# Altium project AeroPressureSensors.PrjPCB
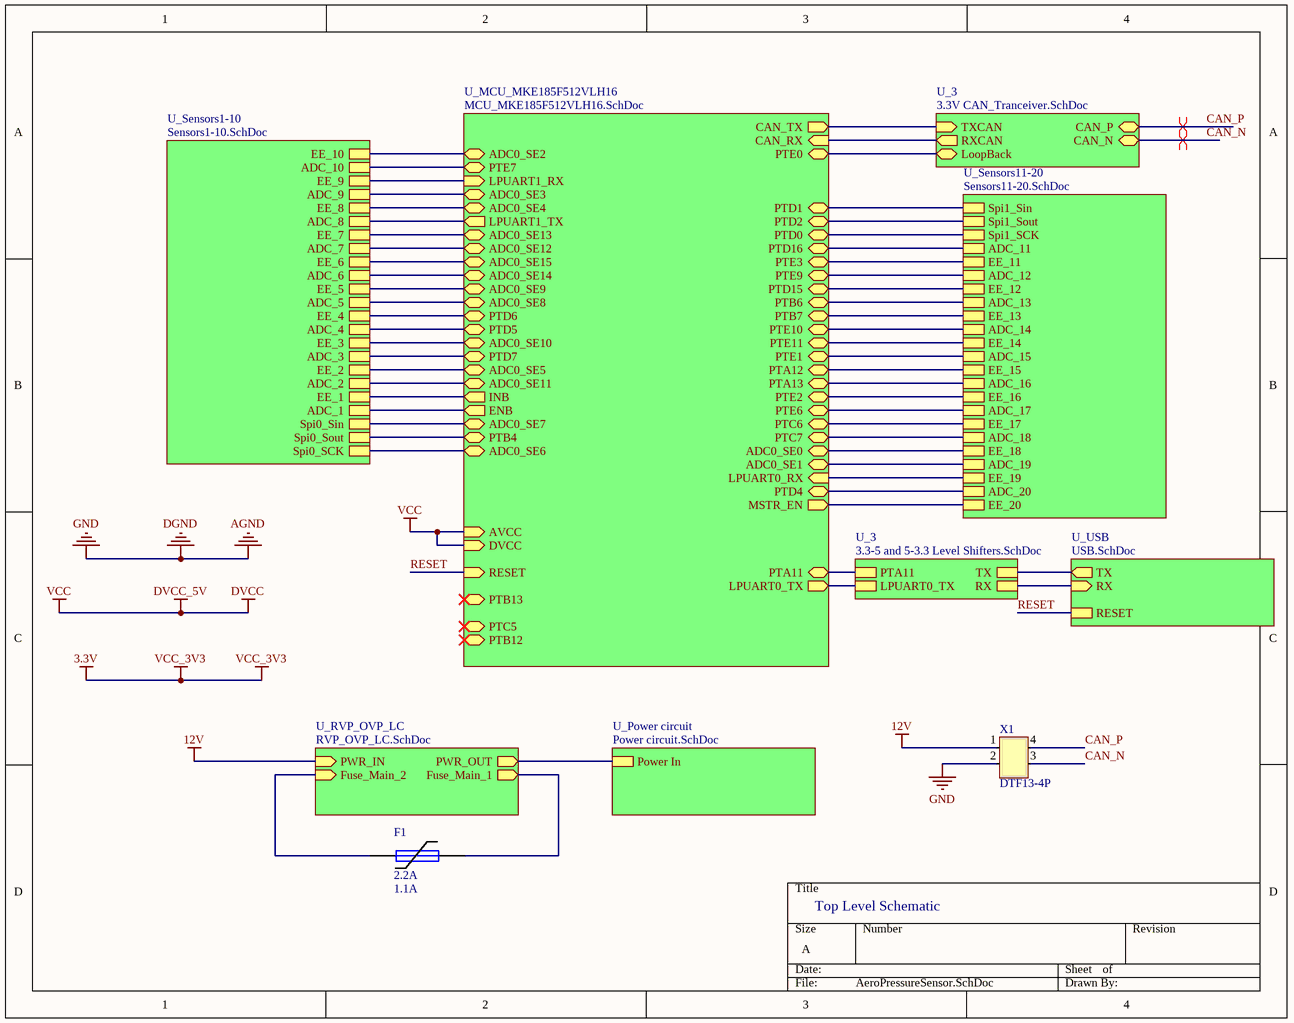
[diagram p0: AeroPressureSensor.SchDoc]
6 sheets, 127 parts. Net scope: hierarchical (ports join the sheet entries above them; power ports are global).
Board file: Pressure_Tap_Board.PcbDoc
Sheets:
  AeroPressureSensor.SchDoc
    U_Sensors1-10 = Sensors1-10.SchDoc
    U_Sensors11-20 = Sensors11-20.SchDoc
    U_Power circuit = Power circuit.SchDoc
    U_3 = 3.3V CAN_Tranceiver.SchDoc
    U_3 = 3.3-5 and 5-3.3 Level Shifters.SchDoc

## Sheet AeroPressureSensor.SchDoc
size A

### Parts
F1  2.2A  I_hold: 1.1A  [PTC Fuse 1206/3216]
X1  DTF13-4P  [DTF13-4P]

### Sub-sheets
U_3 = 3.3V CAN_Tranceiver.SchDoc: TXCAN (in), RXCAN (out), CAN_P (bidir), CAN_N (bidir), LoopBack (bidir)
U_3 = 3.3-5 and 5-3.3 Level Shifters.SchDoc: LPUART0_TX, RX, TX, PTA11
U_MCU_MKE185F512VLH16 = MCU_MKE185F512VLH16.SchDoc (file not in this document): CAN_TX (out), CAN_RX (in), INB (out), ENB (out), ADC0_SE11 (bidir), ADC0_SE10 (bidir), ADC0_SE9 (bidir), ADC0_SE8 (bidir), ADC0_SE15 (bidir), ADC0_SE14 (bidir), ADC0_SE13 (bidir), ADC0_SE12 (bidir), ADC0_SE7 (bidir), ADC0_SE6 (bidir), ADC0_SE1 (bidir), ADC0_SE0 (bidir), LPUART0_TX (out), LPUART0_RX (in), MSTR_EN (out), ADC0_SE5 (bidir), ADC0_SE4 (bidir), LPUART1_TX (out), LPUART1_RX (in), ADC0_SE3 (bidir), ADC0_SE2 (bidir), DVCC (in), AVCC (in), PTD5 (bidir), PTD6 (bidir), PTD7 (bidir), PTB4 (bidir), PTE9 (bidir), PTD15 (bidir), PTD16 (bidir), PTE3 (bidir), PTB6 (bidir), PTB7 (bidir), PTE10 (bidir), PTE11 (bidir), PTD0 (bidir), PTD1 (bidir), PTC7 (bidir), PTC6 (bidir), PTE6 (bidir), PTE2 (bidir), PTA13 (bidir), PTA12 (bidir), PTA11 (bidir), PTE1 (bidir), PTE0 (bidir), RESET (in), PTD2 (bidir), PTD4 (bidir), PTB13 (bidir), PTB12 (bidir), PTE7 (bidir), PTC5 (bidir)
U_Power circuit = Power circuit.SchDoc: Power In
U_RVP_OVP_LC = RVP_OVP_LC.SchDoc (file not in this document): PWR_IN (in), Fuse_Main_2 (in), Fuse_Main_1 (out), PWR_OUT (out)
U_Sensors1-10 = Sensors1-10.SchDoc: EE_1, Spi0_Sin, Spi0_SCK, Spi0_Sout, ADC_1, ADC_2, EE_2, EE_3, ADC_3, ADC_4, EE_4, EE_5, ADC_5, ADC_6, EE_6, EE_7, ADC_7, ADC_8, EE_8, EE_9, ADC_9, ADC_10, EE_10
U_Sensors11-20 = Sensors11-20.SchDoc: EE_11, Spi1_Sin, Spi1_SCK, Spi1_Sout, ADC_11, ADC_12, EE_12, EE_13, ADC_13, ADC_14, EE_14, EE_15, ADC_15, ADC_16, EE_16, EE_17, ADC_17, ADC_18, EE_18, EE_19, ADC_19, ADC_20, EE_20
U_USB = USB.SchDoc (file not in this document): TX (out), RX (in), RESET

### Nets
12V: X1.1 ; sheet U_RVP_OVP_LC/PWR_IN
AGND: X1.2  [also labelled DGND, GND]
DVCC: sheet U_MCU_MKE185F512VLH16/DVCC, sheet U_MCU_MKE185F512VLH16/AVCC  [also labelled DVCC_5V, VCC]
ADC1: sheet U_MCU_MKE185F512VLH16/ENB, sheet U_Sensors1-10/ADC_1
ADC2: sheet U_MCU_MKE185F512VLH16/ADC0_SE11, sheet U_Sensors1-10/ADC_2
ADC3: sheet U_MCU_MKE185F512VLH16/PTD7, sheet U_Sensors1-10/ADC_3
ADC4: sheet U_MCU_MKE185F512VLH16/PTD5, sheet U_Sensors1-10/ADC_4
ADC5: sheet U_MCU_MKE185F512VLH16/ADC0_SE8, sheet U_Sensors1-10/ADC_5
ADC6: sheet U_MCU_MKE185F512VLH16/ADC0_SE14, sheet U_Sensors1-10/ADC_6
ADC7: sheet U_MCU_MKE185F512VLH16/ADC0_SE12, sheet U_Sensors1-10/ADC_7
ADC8: sheet U_MCU_MKE185F512VLH16/LPUART1_TX, sheet U_Sensors1-10/ADC_8
ADC9: sheet U_MCU_MKE185F512VLH16/ADC0_SE3, sheet U_Sensors1-10/ADC_9
ADC10: sheet U_MCU_MKE185F512VLH16/PTE7, sheet U_Sensors1-10/ADC_10
ADC11: sheet U_MCU_MKE185F512VLH16/PTD16, sheet U_Sensors11-20/ADC_11
ADC12: sheet U_MCU_MKE185F512VLH16/PTE9, sheet U_Sensors11-20/ADC_12
ADC13: sheet U_MCU_MKE185F512VLH16/PTB6, sheet U_Sensors11-20/ADC_13
ADC14: sheet U_MCU_MKE185F512VLH16/PTE10, sheet U_Sensors11-20/ADC_14
ADC15: sheet U_MCU_MKE185F512VLH16/PTE1, sheet U_Sensors11-20/ADC_15
ADC16: sheet U_MCU_MKE185F512VLH16/PTA13, sheet U_Sensors11-20/ADC_16
ADC17: sheet U_MCU_MKE185F512VLH16/PTE6, sheet U_Sensors11-20/ADC_17
ADC18: sheet U_MCU_MKE185F512VLH16/PTC7, sheet U_Sensors11-20/ADC_18
ADC19: sheet U_MCU_MKE185F512VLH16/ADC0_SE1, sheet U_Sensors11-20/ADC_19
ADC20: sheet U_MCU_MKE185F512VLH16/PTD4, sheet U_Sensors11-20/ADC_20
CAN_N: X1.3 ; sheet U_3/CAN_N
CAN_P: X1.4 ; sheet U_3/CAN_P
Clk1-10: sheet U_MCU_MKE185F512VLH16/ADC0_SE6, sheet U_Sensors1-10/Spi0_SCK
Clk11-20: sheet U_MCU_MKE185F512VLH16/PTD0, sheet U_Sensors11-20/Spi1_SCK
Din1-10: sheet U_MCU_MKE185F512VLH16/PTB4, sheet U_Sensors1-10/Spi0_Sout
Din11-20: sheet U_MCU_MKE185F512VLH16/PTD2, sheet U_Sensors11-20/Spi1_Sout
Dout1-10: sheet U_MCU_MKE185F512VLH16/ADC0_SE7, sheet U_Sensors1-10/Spi0_Sin
Dout11-20: sheet U_MCU_MKE185F512VLH16/PTD1, sheet U_Sensors11-20/Spi1_Sin
EE1: sheet U_MCU_MKE185F512VLH16/INB, sheet U_Sensors1-10/EE_1
EE2: sheet U_MCU_MKE185F512VLH16/ADC0_SE5, sheet U_Sensors1-10/EE_2
EE3: sheet U_MCU_MKE185F512VLH16/ADC0_SE10, sheet U_Sensors1-10/EE_3
EE4: sheet U_MCU_MKE185F512VLH16/PTD6, sheet U_Sensors1-10/EE_4
EE5: sheet U_MCU_MKE185F512VLH16/ADC0_SE9, sheet U_Sensors1-10/EE_5
EE6: sheet U_MCU_MKE185F512VLH16/ADC0_SE15, sheet U_Sensors1-10/EE_6
EE7: sheet U_MCU_MKE185F512VLH16/ADC0_SE13, sheet U_Sensors1-10/EE_7
EE8: sheet U_MCU_MKE185F512VLH16/ADC0_SE4, sheet U_Sensors1-10/EE_8
EE9: sheet U_MCU_MKE185F512VLH16/LPUART1_RX, sheet U_Sensors1-10/EE_9
EE10: sheet U_MCU_MKE185F512VLH16/ADC0_SE2, sheet U_Sensors1-10/EE_10
EE11: sheet U_MCU_MKE185F512VLH16/PTE3, sheet U_Sensors11-20/EE_11
EE12: sheet U_MCU_MKE185F512VLH16/PTD15, sheet U_Sensors11-20/EE_12
EE13: sheet U_MCU_MKE185F512VLH16/PTB7, sheet U_Sensors11-20/EE_13
EE14: sheet U_MCU_MKE185F512VLH16/PTE11, sheet U_Sensors11-20/EE_14
EE15: sheet U_MCU_MKE185F512VLH16/PTA12, sheet U_Sensors11-20/EE_15
EE16: sheet U_MCU_MKE185F512VLH16/PTE2, sheet U_Sensors11-20/EE_16
EE17: sheet U_MCU_MKE185F512VLH16/PTC6, sheet U_Sensors11-20/EE_17
EE18: sheet U_MCU_MKE185F512VLH16/ADC0_SE0, sheet U_Sensors11-20/EE_18
EE19: sheet U_MCU_MKE185F512VLH16/LPUART0_RX, sheet U_Sensors11-20/EE_19
EE20: sheet U_MCU_MKE185F512VLH16/MSTR_EN, sheet U_Sensors11-20/EE_20
FTDI_RX: sheet U_USB/RX, sheet U_3/RX
LoopBack: sheet U_MCU_MKE185F512VLH16/PTE0, sheet U_3/LoopBack
MCU_RX: sheet U_MCU_MKE185F512VLH16/PTA11, sheet U_3/PTA11
MCU_TX: sheet U_MCU_MKE185F512VLH16/LPUART0_TX, sheet U_3/LPUART0_TX
Power In: sheet U_RVP_OVP_LC/PWR_OUT, sheet U_Power circuit/Power In
RESET: sheet U_MCU_MKE185F512VLH16/RESET, sheet U_USB/RESET
TFTDI_TX: sheet U_USB/TX, sheet U_3/TX
NetF1_1: F1.1 ; sheet U_RVP_OVP_LC/Fuse_Main_2
NetF1_2: F1.2 ; sheet U_RVP_OVP_LC/Fuse_Main_1
NetU4_1: sheet U_MCU_MKE185F512VLH16/CAN_TX, sheet U_3/TXCAN
NetU4_4: sheet U_MCU_MKE185F512VLH16/CAN_RX, sheet U_3/RXCAN

### Layout directives
differential pair: CAN_N, CAN_P

### Notes on the sheet
- Top Level Schematic

### Library data of the parts
F1 = 8: Fuse; Manufacturer_id: 1; MfrPartNo: 1206L110/12SLYR; idFuse: 8; Name: Resettable; I_max: 50A; V_max: 12V; Pd_Typ: .8W; Published: 8-Jun-2000; LatestRevisionDate: 17-Jul-2002; LatestRevisionNote: Re-released for DXP Platform.; PackageReference: PIN-W2/E2.8; Publisher: Altium Limited; PackageDescription: Thru-Hole; 2 Leads; Drawer_id: 1; I_trip: 2.2A; Link: https://www.digikey.com/product-detail/en/littelfuse-inc/1206L110-12SLYR/F5764CT-ND/3593809
X1 = 15: 2 row 4 pin Board; Manufacturer_id: 1; idConn: 15; Value: CONN; Num_Contacts: 4; Created_By: Angel; MfrPartNo: DTF13-4P; Drawer_id: 1; Name: DTF13-4P; Link: https://www.te.com/usa-en/product-DTF13-4P.html; ComponentLink1Description: Datasheet; Supplier1: TE

## Sheet Sensors1-10.SchDoc
size A
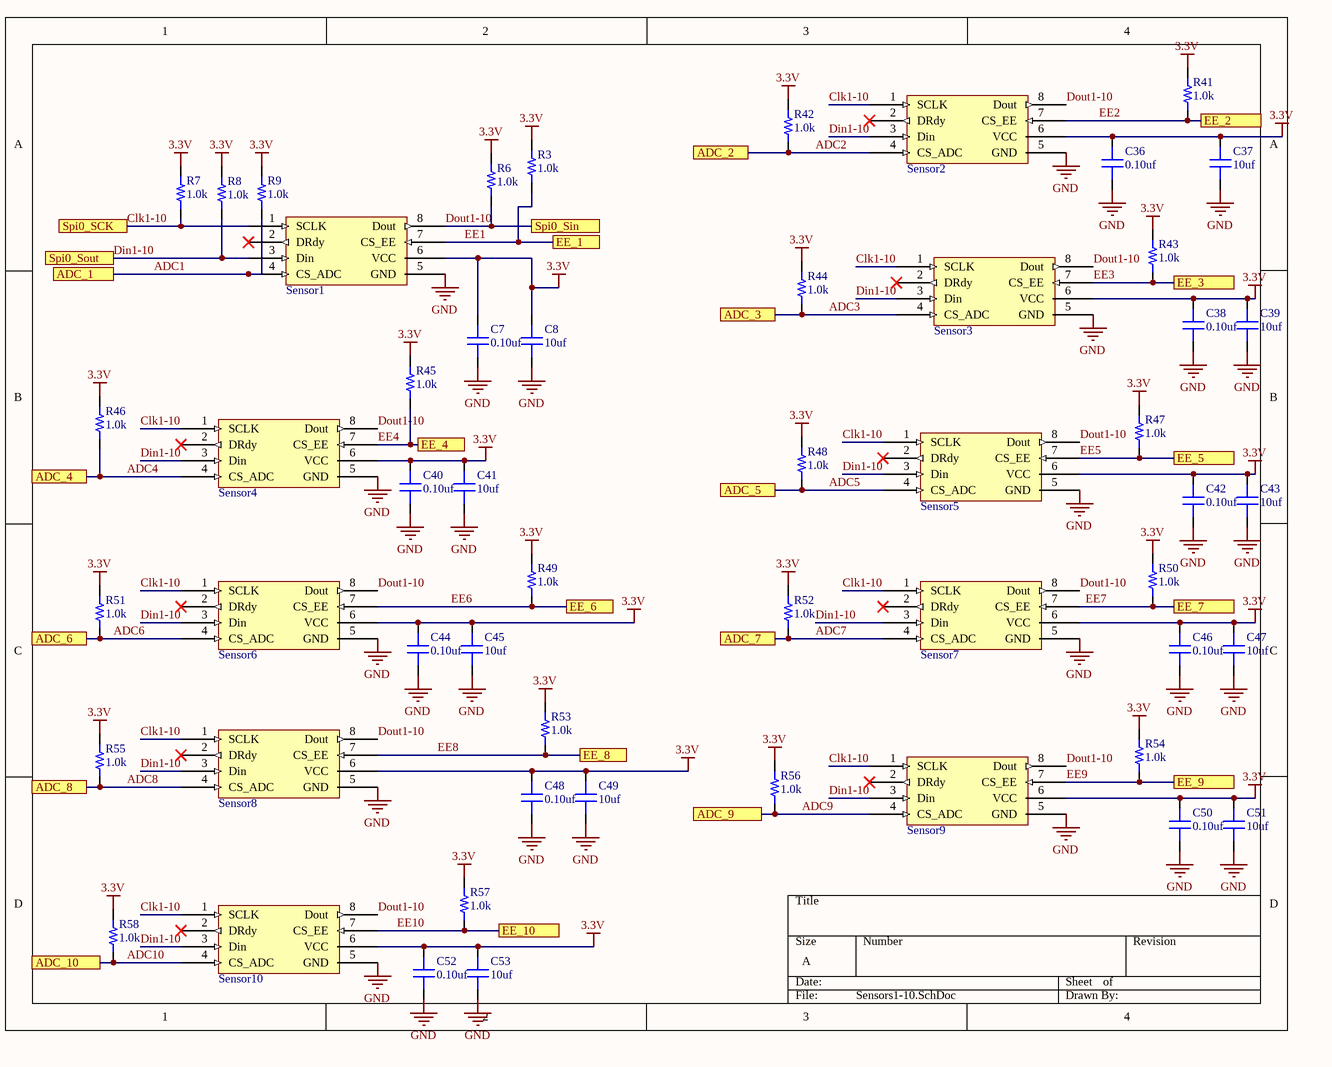
[diagram p1: Sensors1-10.SchDoc]

### Parts
C7  value 0.10uf  [CAP 0603/1608]  (hidden comment: Capacitor MLCC 0.10uf 16V CAP 0603/1608)
C8  value 10uf  [CAP 0603/1608]  (hidden comment: Capacitor MLCC 10uf 16V CAP 0603/1608)
C36  value 0.10uf  [CAP 0603/1608]  (hidden comment: Capacitor MLCC 0.10uf 16V CAP 0603/1608)
C37  value 10uf  [CAP 0603/1608]  (hidden comment: Capacitor MLCC 10uf 16V CAP 0603/1608)
C38  value 0.10uf  [CAP 0603/1608]  (hidden comment: Capacitor MLCC 0.10uf 16V CAP 0603/1608)
C39  value 10uf  [CAP 0603/1608]  (hidden comment: Capacitor MLCC 10uf 16V CAP 0603/1608)
C40  value 0.10uf  [CAP 0603/1608]  (hidden comment: Capacitor MLCC 0.10uf 16V CAP 0603/1608)
C41  value 10uf  [CAP 0603/1608]  (hidden comment: Capacitor MLCC 10uf 16V CAP 0603/1608)
C42  value 0.10uf  [CAP 0603/1608]  (hidden comment: Capacitor MLCC 0.10uf 16V CAP 0603/1608)
C43  value 10uf  [CAP 0603/1608]  (hidden comment: Capacitor MLCC 10uf 16V CAP 0603/1608)
C44  value 0.10uf  [CAP 0603/1608]  (hidden comment: Capacitor MLCC 0.10uf 16V CAP 0603/1608)
C45  value 10uf  [CAP 0603/1608]  (hidden comment: Capacitor MLCC 10uf 16V CAP 0603/1608)
C46  value 0.10uf  [CAP 0603/1608]  (hidden comment: Capacitor MLCC 0.10uf 16V CAP 0603/1608)
C47  value 10uf  [CAP 0603/1608]  (hidden comment: Capacitor MLCC 10uf 16V CAP 0603/1608)
C48  value 0.10uf  [CAP 0603/1608]  (hidden comment: Capacitor MLCC 0.10uf 16V CAP 0603/1608)
C49  value 10uf  [CAP 0603/1608]  (hidden comment: Capacitor MLCC 10uf 16V CAP 0603/1608)
C50  value 0.10uf  [CAP 0603/1608]  (hidden comment: Capacitor MLCC 0.10uf 16V CAP 0603/1608)
C51  value 10uf  [CAP 0603/1608]  (hidden comment: Capacitor MLCC 10uf 16V CAP 0603/1608)
C52  value 0.10uf  [CAP 0603/1608]  (hidden comment: Capacitor MLCC 0.10uf 16V CAP 0603/1608)
C53  value 10uf  [CAP 0603/1608]  (hidden comment: Capacitor MLCC 10uf 16V CAP 0603/1608)
R3  value 1.0k  [RES 0603/1608]  (hidden comment: Resistor 1.0k 0603 1/10W 5%)
R6  value 1.0k  [RES 0603/1608]  (hidden comment: Resistor 1.0k 0603 1/10W 5%)
R7  value 1.0k  [RES 0603/1608]  (hidden comment: Resistor 1.0k 0603 1/10W 5%)
R8  value 1.0k  [RES 0603/1608]  (hidden comment: Resistor 1.0k 0603 1/10W 5%)
R9  value 1.0k  [RES 0603/1608]  (hidden comment: Resistor 1.0k 0603 1/10W 5%)
R41  value 1.0k  [RES 0603/1608]  (hidden comment: Resistor 1.0k 0603 1/10W 5%)
R42  value 1.0k  [RES 0603/1608]  (hidden comment: Resistor 1.0k 0603 1/10W 5%)
R43  value 1.0k  [RES 0603/1608]  (hidden comment: Resistor 1.0k 0603 1/10W 5%)
R44  value 1.0k  [RES 0603/1608]  (hidden comment: Resistor 1.0k 0603 1/10W 5%)
R45  value 1.0k  [RES 0603/1608]  (hidden comment: Resistor 1.0k 0603 1/10W 5%)
R46  value 1.0k  [RES 0603/1608]  (hidden comment: Resistor 1.0k 0603 1/10W 5%)
R47  value 1.0k  [RES 0603/1608]  (hidden comment: Resistor 1.0k 0603 1/10W 5%)
R48  value 1.0k  [RES 0603/1608]  (hidden comment: Resistor 1.0k 0603 1/10W 5%)
R49  value 1.0k  [RES 0603/1608]  (hidden comment: Resistor 1.0k 0603 1/10W 5%)
R50  value 1.0k  [RES 0603/1608]  (hidden comment: Resistor 1.0k 0603 1/10W 5%)
R51  value 1.0k  [RES 0603/1608]  (hidden comment: Resistor 1.0k 0603 1/10W 5%)
R52  value 1.0k  [RES 0603/1608]  (hidden comment: Resistor 1.0k 0603 1/10W 5%)
R53  value 1.0k  [RES 0603/1608]  (hidden comment: Resistor 1.0k 0603 1/10W 5%)
R54  value 1.0k  [RES 0603/1608]  (hidden comment: Resistor 1.0k 0603 1/10W 5%)
R55  value 1.0k  [RES 0603/1608]  (hidden comment: Resistor 1.0k 0603 1/10W 5%)
R56  value 1.0k  [RES 0603/1608]  (hidden comment: Resistor 1.0k 0603 1/10W 5%)
R57  value 1.0k  [RES 0603/1608]  (hidden comment: Resistor 1.0k 0603 1/10W 5%)
R58  value 1.0k  [RES 0603/1608]  (hidden comment: Resistor 1.0k 0603 1/10W 5%)
Sensor1  for Aero Pressure Sensor Board  [RSCMJJM005NDSE3 Pressure Sensor]  (value not drawn)
Sensor2  for Aero Pressure Sensor Board  [RSCMJJM005NDSE3 Pressure Sensor]  (value not drawn)
Sensor3  for Aero Pressure Sensor Board  [RSCMJJM005NDSE3 Pressure Sensor]  (value not drawn)
Sensor4  for Aero Pressure Sensor Board  [RSCMJJM005NDSE3 Pressure Sensor]  (value not drawn)
Sensor5  for Aero Pressure Sensor Board  [RSCMJJM005NDSE3 Pressure Sensor]  (value not drawn)
Sensor6  for Aero Pressure Sensor Board  [RSCMJJM005NDSE3 Pressure Sensor]  (value not drawn)
Sensor7  for Aero Pressure Sensor Board  [RSCMJJM005NDSE3 Pressure Sensor]  (value not drawn)
Sensor8  for Aero Pressure Sensor Board  [RSCMJJM005NDSE3 Pressure Sensor]  (value not drawn)
Sensor9  for Aero Pressure Sensor Board  [RSCMJJM005NDSE3 Pressure Sensor]  (value not drawn)
Sensor10  for Aero Pressure Sensor Board  [RSCMJJM005NDSE3 Pressure Sensor]  (value not drawn)

### Ports
ADC_1, ADC_2, ADC_3, ADC_4, ADC_5, ADC_6, ADC_7, ADC_8, ADC_9, ADC_10, EE_1, EE_2, EE_3, EE_4, EE_5, EE_6, EE_7, EE_8, EE_9, EE_10, Spi0_SCK, Spi0_Sin, Spi0_Sout

### Nets
3.3V: C7.2 C8.2 C36.2 C37.2 C38.2 C39.2 C40.2 C41.2 C42.2 C43.2 C44.2 C45.2 C46.2 C47.2 C48.2 C49.2 C50.2 C51.2 C52.2 C53.2 R3.2 R6.2 R7.2 R8.2 R9.2 R41.2 R42.2 R43.2 R44.2 R45.2 R46.2 R47.2 R48.2 R49.2 R50.2 R51.2 R52.2 R53.2 R54.2 R55.2 R56.2 R57.2 R58.2 Sensor1.6(VCC) Sensor2.6(VCC) Sensor3.6(VCC) Sensor4.6(VCC) Sensor5.6(VCC) Sensor6.6(VCC) Sensor7.6(VCC) Sensor8.6(VCC) Sensor9.6(VCC) Sensor10.6(VCC)
GND: C7.1 C8.1 C36.1 C37.1 C38.1 C39.1 C40.1 C41.1 C42.1 C43.1 C44.1 C45.1 C46.1 C47.1 C48.1 C49.1 C50.1 C51.1 C52.1 C53.1 Sensor1.5(GND) Sensor2.5(GND) Sensor3.5(GND) Sensor4.5(GND) Sensor5.5(GND) Sensor6.5(GND) Sensor7.5(GND) Sensor8.5(GND) Sensor9.5(GND) Sensor10.5(GND)  [project net AGND]
ADC1: R9.1 Sensor1.4(CS_ADC) ; port ADC_1
ADC2: R42.1 Sensor2.4(CS_ADC) ; port ADC_2
ADC3: R44.1 Sensor3.4(CS_ADC) ; port ADC_3
ADC4: R46.1 Sensor4.4(CS_ADC) ; port ADC_4
ADC5: R48.1 Sensor5.4(CS_ADC) ; port ADC_5
ADC6: R51.1 Sensor6.4(CS_ADC) ; port ADC_6
ADC7: R52.1 Sensor7.4(CS_ADC) ; port ADC_7
ADC8: R55.1 Sensor8.4(CS_ADC) ; port ADC_8
ADC9: R56.1 Sensor9.4(CS_ADC) ; port ADC_9
ADC10: R58.1 Sensor10.4(CS_ADC) ; port ADC_10
Clk1-10: R7.1 Sensor1.1(SCLK) Sensor2.1(SCLK) Sensor3.1(SCLK) Sensor4.1(SCLK) Sensor5.1(SCLK) Sensor6.1(SCLK) Sensor7.1(SCLK) Sensor8.1(SCLK) Sensor9.1(SCLK) Sensor10.1(SCLK) ; port Spi0_SCK
Din1-10: R8.1 Sensor1.3(Din) Sensor2.3(Din) Sensor3.3(Din) Sensor4.3(Din) Sensor5.3(Din) Sensor6.3(Din) Sensor7.3(Din) Sensor8.3(Din) Sensor9.3(Din) Sensor10.3(Din) ; port Spi0_Sout
Dout1-10: R6.1 Sensor1.8(Dout) Sensor2.8(Dout) Sensor3.8(Dout) Sensor4.8(Dout) Sensor5.8(Dout) Sensor6.8(Dout) Sensor7.8(Dout) Sensor8.8(Dout) Sensor9.8(Dout) Sensor10.8(Dout) ; port Spi0_Sin
EE1: R3.1 Sensor1.7(CS_EE) ; port EE_1
EE2: R41.1 Sensor2.7(CS_EE) ; port EE_2
EE3: R43.1 Sensor3.7(CS_EE) ; port EE_3
EE4: R45.1 Sensor4.7(CS_EE) ; port EE_4
EE5: R47.1 Sensor5.7(CS_EE) ; port EE_5
EE6: R49.1 Sensor6.7(CS_EE) ; port EE_6
EE7: R50.1 Sensor7.7(CS_EE) ; port EE_7
EE8: R53.1 Sensor8.7(CS_EE) ; port EE_8
EE9: R54.1 Sensor9.7(CS_EE) ; port EE_9
EE10: R57.1 Sensor10.7(CS_EE) ; port EE_10

Not connected (* = marked no-connect by the designer): Sensor1 2(DRdy)*; Sensor2 2(DRdy)*; Sensor3 2(DRdy)*; Sensor4 2(DRdy)*; Sensor5 2(DRdy)*; Sensor6 2(DRdy)*; Sensor7 2(DRdy)*; Sensor8 2(DRdy)*; Sensor9 2(DRdy)*; Sensor10 2(DRdy)*

### Library data of the parts
C7 C36 C38 C40 C42 C44 C46 C48 C50 C52 = 223: Manufacturer_id: 1; idCapacitor: 223; Name: Cap_0.10uf_16V_CAP 0603/1608; Dielectric: Ceramic; Created_By: Nick Mah; Drawer_id: 1; Voltage_Rating: 16V; Package: CAP 0603/1608; Created_Date: 10/20/2018
C8 C37 C39 C41 C43 C45 C47 C49 C51 C53 = 235: Manufacturer_id: 1; idCapacitor: 235; Name: Cap_10uf_16V_CAP 0603/1608; Dielectric: Ceramic; Created_By: Nick Mah; Drawer_id: 1; Voltage_Rating: 16V; Package: CAP 0603/1608; Created_Date: 10/20/2018
R3 R6-R9 R41-R58 = 1369: Manufacturer_id: 1; idResistor: 1369; Name: Res_1.0k_0603_1/10W_5%; Created_By: Nick Mah; Supplier 1: Digi-Key; Drawer_id: 1; Tolerance: 5%; Power: 1/10W; Package: 0603; ComponentLink1Description: Datasheet; Created_Date: 2018-10-20
Sensor1-Sensor10 = 27: RSCMJJM005NDSE3 Pressure Sensor; Manufacturer_id: 1; idIC_Misc: 27; Vin(Min): 2.7; Vin(Max): 3.3; Drawer_id: 1; Name: RSCMJJM005NDSE3 Pressure Sensor; Link: https://sensing.honeywell.com/RSCMJJM005NDSE3-amplified-board-mount-pressure-sensors

## Sheet Sensors11-20.SchDoc
size A
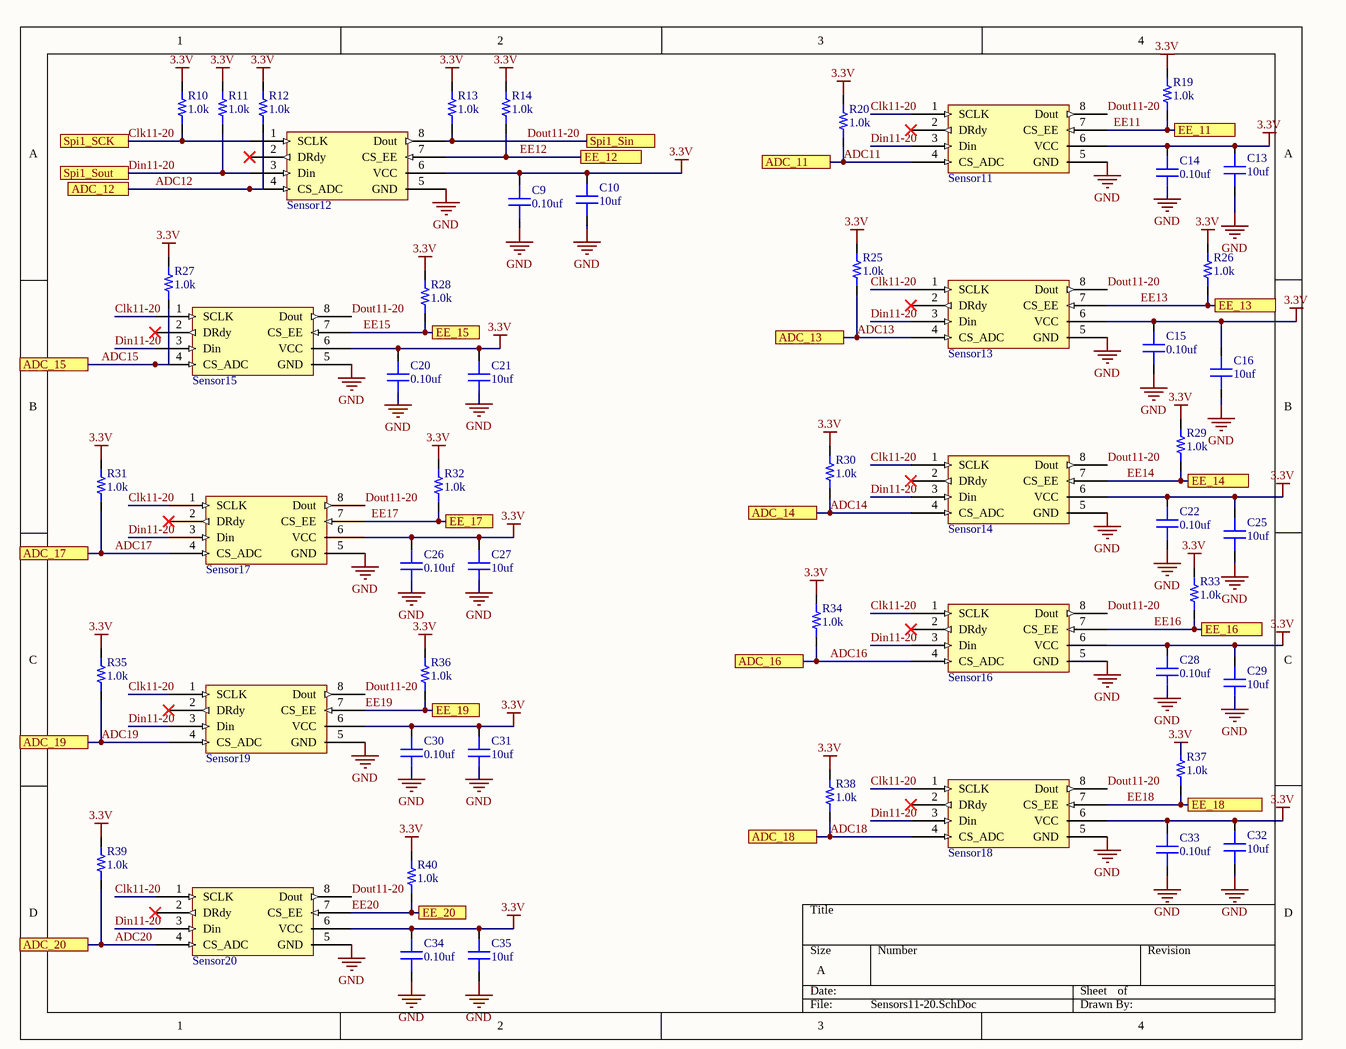
[diagram p2: Sensors11-20.SchDoc]

### Parts
C9  value 0.10uf  [CAP 0603/1608]  (hidden comment: Capacitor MLCC 0.10uf 16V CAP 0603/1608)
C10  value 10uf  [CAP 0603/1608]  (hidden comment: Capacitor MLCC 10uf 16V CAP 0603/1608)
C13  value 10uf  [CAP 0603/1608]  (hidden comment: Capacitor MLCC 10uf 16V CAP 0603/1608)
C14  value 0.10uf  [CAP 0603/1608]  (hidden comment: Capacitor MLCC 0.10uf 16V CAP 0603/1608)
C15  value 0.10uf  [CAP 0603/1608]  (hidden comment: Capacitor MLCC 0.10uf 16V CAP 0603/1608)
C16  value 10uf  [CAP 0603/1608]  (hidden comment: Capacitor MLCC 10uf 16V CAP 0603/1608)
C20  value 0.10uf  [CAP 0603/1608]  (hidden comment: Capacitor MLCC 0.10uf 16V CAP 0603/1608)
C21  value 10uf  [CAP 0603/1608]  (hidden comment: Capacitor MLCC 10uf 16V CAP 0603/1608)
C22  value 0.10uf  [CAP 0603/1608]  (hidden comment: Capacitor MLCC 0.10uf 16V CAP 0603/1608)
C25  value 10uf  [CAP 0603/1608]  (hidden comment: Capacitor MLCC 10uf 16V CAP 0603/1608)
C26  value 0.10uf  [CAP 0603/1608]  (hidden comment: Capacitor MLCC 0.10uf 16V CAP 0603/1608)
C27  value 10uf  [CAP 0603/1608]  (hidden comment: Capacitor MLCC 10uf 16V CAP 0603/1608)
C28  value 0.10uf  [CAP 0603/1608]  (hidden comment: Capacitor MLCC 0.10uf 16V CAP 0603/1608)
C29  value 10uf  [CAP 0603/1608]  (hidden comment: Capacitor MLCC 10uf 16V CAP 0603/1608)
C30  value 0.10uf  [CAP 0603/1608]  (hidden comment: Capacitor MLCC 0.10uf 16V CAP 0603/1608)
C31  value 10uf  [CAP 0603/1608]  (hidden comment: Capacitor MLCC 10uf 16V CAP 0603/1608)
C32  value 10uf  [CAP 0603/1608]  (hidden comment: Capacitor MLCC 10uf 16V CAP 0603/1608)
C33  value 0.10uf  [CAP 0603/1608]  (hidden comment: Capacitor MLCC 0.10uf 16V CAP 0603/1608)
C34  value 0.10uf  [CAP 0603/1608]  (hidden comment: Capacitor MLCC 0.10uf 16V CAP 0603/1608)
C35  value 10uf  [CAP 0603/1608]  (hidden comment: Capacitor MLCC 10uf 16V CAP 0603/1608)
R10  value 1.0k  [RES 0603/1608]  (hidden comment: Resistor 1.0k 0603 1/10W 5%)
R11  value 1.0k  [RES 0603/1608]  (hidden comment: Resistor 1.0k 0603 1/10W 5%)
R12  value 1.0k  [RES 0603/1608]  (hidden comment: Resistor 1.0k 0603 1/10W 5%)
R13  value 1.0k  [RES 0603/1608]  (hidden comment: Resistor 1.0k 0603 1/10W 5%)
R14  value 1.0k  [RES 0603/1608]  (hidden comment: Resistor 1.0k 0603 1/10W 5%)
R19  value 1.0k  [RES 0603/1608]  (hidden comment: Resistor 1.0k 0603 1/10W 5%)
R20  value 1.0k  [RES 0603/1608]  (hidden comment: Resistor 1.0k 0603 1/10W 5%)
R25  value 1.0k  [RES 0603/1608]  (hidden comment: Resistor 1.0k 0603 1/10W 5%)
R26  value 1.0k  [RES 0603/1608]  (hidden comment: Resistor 1.0k 0603 1/10W 5%)
R27  value 1.0k  [RES 0603/1608]  (hidden comment: Resistor 1.0k 0603 1/10W 5%)
R28  value 1.0k  [RES 0603/1608]  (hidden comment: Resistor 1.0k 0603 1/10W 5%)
R29  value 1.0k  [RES 0603/1608]  (hidden comment: Resistor 1.0k 0603 1/10W 5%)
R30  value 1.0k  [RES 0603/1608]  (hidden comment: Resistor 1.0k 0603 1/10W 5%)
R31  value 1.0k  [RES 0603/1608]  (hidden comment: Resistor 1.0k 0603 1/10W 5%)
R32  value 1.0k  [RES 0603/1608]  (hidden comment: Resistor 1.0k 0603 1/10W 5%)
R33  value 1.0k  [RES 0603/1608]  (hidden comment: Resistor 1.0k 0603 1/10W 5%)
R34  value 1.0k  [RES 0603/1608]  (hidden comment: Resistor 1.0k 0603 1/10W 5%)
R35  value 1.0k  [RES 0603/1608]  (hidden comment: Resistor 1.0k 0603 1/10W 5%)
R36  value 1.0k  [RES 0603/1608]  (hidden comment: Resistor 1.0k 0603 1/10W 5%)
R37  value 1.0k  [RES 0603/1608]  (hidden comment: Resistor 1.0k 0603 1/10W 5%)
R38  value 1.0k  [RES 0603/1608]  (hidden comment: Resistor 1.0k 0603 1/10W 5%)
R39  value 1.0k  [RES 0603/1608]  (hidden comment: Resistor 1.0k 0603 1/10W 5%)
R40  value 1.0k  [RES 0603/1608]  (hidden comment: Resistor 1.0k 0603 1/10W 5%)
Sensor11  for Aero Pressure Sensor Board  [RSCMJJM005NDSE3 Pressure Sensor]  (value not drawn)
Sensor12  for Aero Pressure Sensor Board  [RSCMJJM005NDSE3 Pressure Sensor]  (value not drawn)
Sensor13  for Aero Pressure Sensor Board  [RSCMJJM005NDSE3 Pressure Sensor]  (value not drawn)
Sensor14  for Aero Pressure Sensor Board  [RSCMJJM005NDSE3 Pressure Sensor]  (value not drawn)
Sensor15  for Aero Pressure Sensor Board  [RSCMJJM005NDSE3 Pressure Sensor]  (value not drawn)
Sensor16  for Aero Pressure Sensor Board  [RSCMJJM005NDSE3 Pressure Sensor]  (value not drawn)
Sensor17  for Aero Pressure Sensor Board  [RSCMJJM005NDSE3 Pressure Sensor]  (value not drawn)
Sensor18  for Aero Pressure Sensor Board  [RSCMJJM005NDSE3 Pressure Sensor]  (value not drawn)
Sensor19  for Aero Pressure Sensor Board  [RSCMJJM005NDSE3 Pressure Sensor]  (value not drawn)
Sensor20  for Aero Pressure Sensor Board  [RSCMJJM005NDSE3 Pressure Sensor]  (value not drawn)

### Ports
ADC_11, ADC_12, ADC_13, ADC_14, ADC_15, ADC_16, ADC_17, ADC_18, ADC_19, ADC_20, EE_11, EE_12, EE_13, EE_14, EE_15, EE_16, EE_17, EE_18, EE_19, EE_20, Spi1_SCK, Spi1_Sin, Spi1_Sout

### Nets
3.3V: C9.2 C10.2 C13.2 C14.2 C15.2 C16.2 C20.2 C21.2 C22.2 C25.2 C26.2 C27.2 C28.2 C29.2 C30.2 C31.2 C32.2 C33.2 C34.2 C35.2 R10.2 R11.2 R12.2 R13.2 R14.2 R19.2 R20.2 R25.2 R26.2 R27.2 R28.2 R29.2 R30.2 R31.2 R32.2 R33.2 R34.2 R35.2 R36.2 R37.2 R38.2 R39.2 R40.2 Sensor11.6(VCC) Sensor12.6(VCC) Sensor13.6(VCC) Sensor14.6(VCC) Sensor15.6(VCC) Sensor16.6(VCC) Sensor17.6(VCC) Sensor18.6(VCC) Sensor19.6(VCC) Sensor20.6(VCC)
GND: C9.1 C10.1 C13.1 C14.1 C15.1 C16.1 C20.1 C21.1 C22.1 C25.1 C26.1 C27.1 C28.1 C29.1 C30.1 C31.1 C32.1 C33.1 C34.1 C35.1 Sensor11.5(GND) Sensor12.5(GND) Sensor13.5(GND) Sensor14.5(GND) Sensor15.5(GND) Sensor16.5(GND) Sensor17.5(GND) Sensor18.5(GND) Sensor19.5(GND) Sensor20.5(GND)  [project net AGND]
ADC11: R20.1 Sensor11.4(CS_ADC) ; port ADC_11
ADC12: R12.1 Sensor12.4(CS_ADC) ; port ADC_12
ADC13: R25.1 Sensor13.4(CS_ADC) ; port ADC_13
ADC14: R30.1 Sensor14.4(CS_ADC) ; port ADC_14
ADC15: R27.1 Sensor15.4(CS_ADC) ; port ADC_15
ADC16: R34.1 Sensor16.4(CS_ADC) ; port ADC_16
ADC17: R31.1 Sensor17.4(CS_ADC) ; port ADC_17
ADC18: R38.1 Sensor18.4(CS_ADC) ; port ADC_18
ADC19: R35.1 Sensor19.4(CS_ADC) ; port ADC_19
ADC20: R39.1 Sensor20.4(CS_ADC) ; port ADC_20
Clk11-20: R10.1 Sensor11.1(SCLK) Sensor12.1(SCLK) Sensor13.1(SCLK) Sensor14.1(SCLK) Sensor15.1(SCLK) Sensor16.1(SCLK) Sensor17.1(SCLK) Sensor18.1(SCLK) Sensor19.1(SCLK) Sensor20.1(SCLK) ; port Spi1_SCK
Din11-20: R11.1 Sensor11.3(Din) Sensor12.3(Din) Sensor13.3(Din) Sensor14.3(Din) Sensor15.3(Din) Sensor16.3(Din) Sensor17.3(Din) Sensor18.3(Din) Sensor19.3(Din) Sensor20.3(Din) ; port Spi1_Sout
Dout11-20: R13.1 Sensor11.8(Dout) Sensor12.8(Dout) Sensor13.8(Dout) Sensor14.8(Dout) Sensor15.8(Dout) Sensor16.8(Dout) Sensor17.8(Dout) Sensor18.8(Dout) Sensor19.8(Dout) Sensor20.8(Dout) ; port Spi1_Sin
EE11: R19.1 Sensor11.7(CS_EE) ; port EE_11
EE12: R14.1 Sensor12.7(CS_EE) ; port EE_12
EE13: R26.1 Sensor13.7(CS_EE) ; port EE_13
EE14: R29.1 Sensor14.7(CS_EE) ; port EE_14
EE15: R28.1 Sensor15.7(CS_EE) ; port EE_15
EE16: R33.1 Sensor16.7(CS_EE) ; port EE_16
EE17: R32.1 Sensor17.7(CS_EE) ; port EE_17
EE18: R37.1 Sensor18.7(CS_EE) ; port EE_18
EE19: R36.1 Sensor19.7(CS_EE) ; port EE_19
EE20: R40.1 Sensor20.7(CS_EE) ; port EE_20

Not connected (* = marked no-connect by the designer): Sensor11 2(DRdy)*; Sensor12 2(DRdy)*; Sensor13 2(DRdy)*; Sensor14 2(DRdy)*; Sensor15 2(DRdy)*; Sensor16 2(DRdy)*; Sensor17 2(DRdy)*; Sensor18 2(DRdy)*; Sensor19 2(DRdy)*; Sensor20 2(DRdy)*

### Library data of the parts
C9 C14 C15 C20 C22 C26 C28 C30 C33 C34 = 223: as C7 on sheet Sensors1-10; Drawer_id: 1; Voltage_Rating: 16V; Package: CAP 0603/1608; Created_Date: 10/20/2018
C10 C13 C16 C21 C25 C27 C29 C31 C32 C35 = 235: as C8 on sheet Sensors1-10; Drawer_id: 1; Voltage_Rating: 16V; Package: CAP 0603/1608; Created_Date: 10/20/2018
R10-R14 R19 R20 R25-R40 = 1369: as R3 on sheet Sensors1-10; Supplier 1: Digi-Key; Drawer_id: 1; Tolerance: 5%; Power: 1/10W; Package: 0603; ComponentLink1Description: Datasheet; Created_Date: 2018-10-20
Sensor11-Sensor20 = 27: as Sensor1 on sheet Sensors1-10; Drawer_id: 1; Name: RSCMJJM005NDSE3 Pressure Sensor; Link: https://sensing.honeywell.com/RSCMJJM005NDSE3-amplified-board-mount-pressure-sensors

## Sheet Power circuit.SchDoc
size A
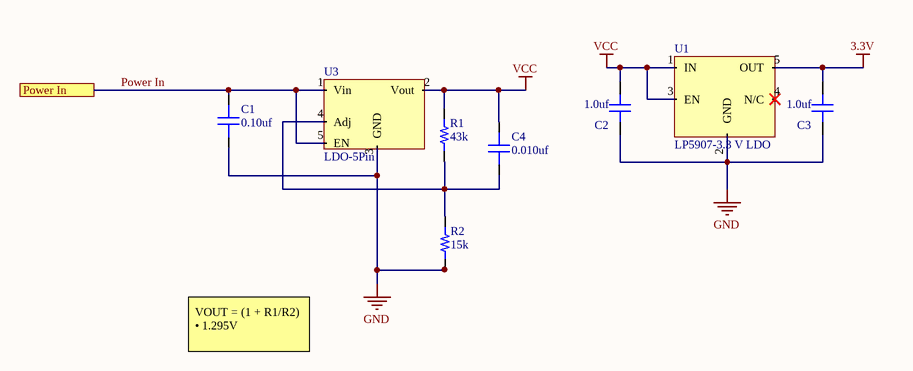
[diagram p3: Power circuit.SchDoc]

### Parts
C1  value 0.10uf  [CAP 0603/1608]  (hidden comment: Capacitor MLCC 0.10uf 16V CAP 0603/1608)
C2  value 1.0uf  [CAP 0603/1608]  (hidden comment: Capacitor MLCC 1.0uf 16V CAP 0603/1608)
C3  value 1.0uf  [CAP 0603/1608]  (hidden comment: Capacitor MLCC 1.0uf 16V CAP 0603/1608)
C4  value 0.010uf  [CAP 0603/1608]  (hidden comment: Capacitor MLCC 0.010uf 16V CAP 0603/1608)
R1  value 43k  [RES 0603/1608]  (hidden comment: Resistor 43k 0603 1/10W 1%)
R2  value 15k  [RES 0603/1608]  (hidden comment: Resistor 15k 0603 1/10W 1%)
U1  LP5907-3.3 V LDO  [SOT23-5]
U3  LDO-5Pin  [SOT223-5]

### Ports
Power In

### Nets
3.3V: C3.2 U1.5(OUT)
GND: C1.1 C2.1 C3.1 R2.1 U1.2(GND) U3.3(GND)  [project net AGND]
VCC: C2.2 C4.2 R1.2 U1.1(IN) U1.3(EN) U3.2(Vout)  [project net DVCC]
Power In: C1.2 U3.1(Vin) U3.5(EN) ; port Power In
NetC4_1: C4.1 R1.1 R2.2 U3.4(Adj)

Not connected (* = marked no-connect by the designer): U1 4(N/C)*

### Notes on the sheet
- VOUT = (1 + R1/R2) • 1.295V

### Library data of the parts
C1 = 223: as C7 on sheet Sensors1-10; Drawer_id: 1; Voltage_Rating: 16V; Package: CAP 0603/1608; Created_Date: 10/20/2018
C2 C3 = 229: Manufacturer_id: 1; idCapacitor: 229; Name: Cap_1.0uf_16V_CAP 0603/1608; Dielectric: Ceramic; Created_By: Nick Mah; Drawer_id: 1; Voltage_Rating: 16V; Package: CAP 0603/1608; Created_Date: 10/20/2018
C4 = 217: Manufacturer_id: 1; idCapacitor: 217; Name: Cap_0.010uf_16V_CAP 0603/1608; Dielectric: Ceramic; Created_By: Nick Mah; Drawer_id: 1; Voltage_Rating: 16V; Package: CAP 0603/1608; Created_Date: 10/20/2018
R1 = 328: Manufacturer_id: 1; idResistor: 328; Name: Res_43k_0603_1/10W_1%; Created_By: Nick Mah; Supplier 1: Digi-Key; Drawer_id: 1; Tolerance: 1%; Power: 1/10W; Package: 0603; ComponentLink1Description: Datasheet; Created_Date: 2018-10-20
R2 = 317: Manufacturer_id: 1; idResistor: 317; Name: Res_15k_0603_1/10W_1%; Created_By: Nick Mah; Supplier 1: Digi-Key; Drawer_id: 1; Tolerance: 1%; Power: 1/10W; Package: 0603; ComponentLink1Description: Datasheet; Created_Date: 2018-10-20
U1 = 4: Manufacturer_id: 1; MfrPartNo: LP5907MFX-3.3/NOPB; idPMIC_Lin: 4; Name: LP5907 LDO; Value: 3.3 V; Vin(Max): 6V; Vout(Min): 3.3V; Drawer_id: 1; Package: SOT23-5; Link: https://www.digikey.com/product-detail/en/texas-instruments/LP5907MFX-3.3-NOPB/296-38557-2-ND/3906441
U3 = 7: Manufacturer_id: 1; MfrPartNo: REG104GA-A; idPMIC_Lin: 7; Name: 5V 1A LDO; Value: 5.5V 1A; Vin(Min): -.3V; Vin(Max): 16V; Vout(Min): 2.5V; Vout(Max): 5V; Current_Rating: 1A; Drawer_id: 1; Num_Outputs: 1; Package: SOT-223-6; Link: https://www.digikey.com/product-detail/en/texas-instruments/REG104GA-A/REG104GA-A-ND/380288?utm_adgroup=Integrated%20Circuits&slid=&gclid=CjwKCAjwpKveBRAwEiwAo4Pqm3P1cbCGhU8VzQ4hsaig_pQLQzWQ1vPK7ianKpgKPxk_g8_0T-ULMBoCGh8QAvD_BwE

## Sheet 3.3V CAN_Tranceiver.SchDoc
size A
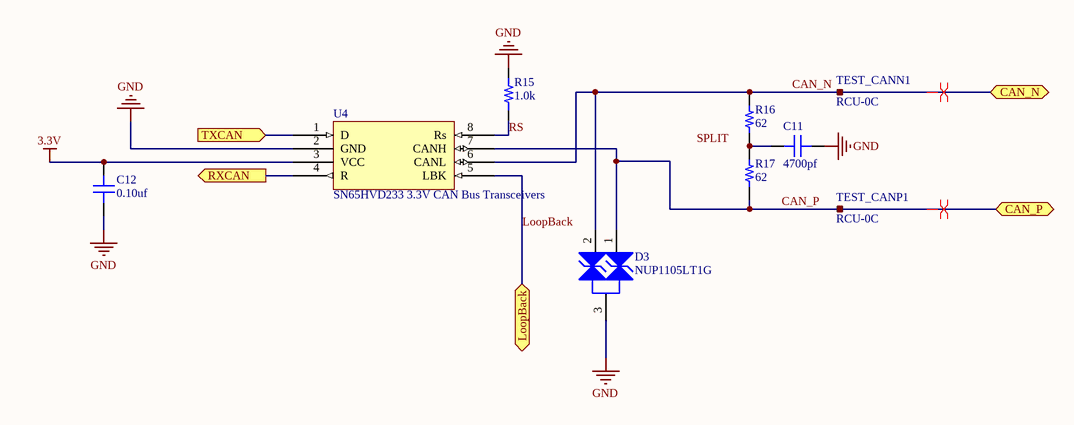
[diagram p4: 3.3V CAN_Tranceiver.SchDoc]

### Parts
C11  value 4700pf  [CAP 0603/1608]  (hidden comment: Capacitor MLCC 4700pf 50V CAP 0603/1608)
C12  value 0.10uf  [CAP 0603/1608]  (hidden comment: Capacitor MLCC 0.10uf 50V CAP 0603/1608)
D3  NUP1105LT1G  [SOT-23 (TO-236)]
R15  value 1.0k  [RES 0603/1608]  (hidden comment: Resistor 1.0k 0603 1/10W 1%)
R16  value 62  [RES 0603/1608]  (hidden comment: Resistor 62 0603 1/10W 5%)
R17  value 62  [RES 0603/1608]  (hidden comment: Resistor 62 0603 1/10W 5%)
TEST_CANN1  RCU-0C  [RCU-0C]
TEST_CANP1  RCU-0C  [RCU-0C]
U4  SN65HVD233 3.3V CAN Bus Transceivers  [SOIC-8]

### Ports
CAN_N (bidir), CAN_P (bidir), LoopBack (bidir), RXCAN (out), TXCAN (in)

### Nets
3.3V: C12.1 U4.3(VCC)
GND: C11.1 C12.2 D3.3(K) R15.2 U4.2(GND)  [project net AGND]
CAN_N: D3.2(K) R16.1 TEST_CANN1.1 U4.6(CANL) ; port CAN_N
CAN_P: D3.1(K) R17.2 TEST_CANP1.1 U4.7(CANH) ; port CAN_P
LoopBack: U4.5(LBK) ; port LoopBack
RS: R15.1 U4.8(Rs)
NetC11_2: C11.2 R16.2 R17.1
NetU4_1: U4.1(D) ; port TXCAN
NetU4_4: U4.4(R) ; port RXCAN

### Layout directives
differential pair: CAN_N, CAN_P

### Notes on the sheet
- Labels drawn without touching a wire or pin: SPLIT

### Library data of the parts
C11 = 929: Manufacturer_id: 1; idCapacitor: 929; Name: Cap_4700pf_50V_CAP 0603/1608; Dielectric: Ceramic; Created_By: Nick Mah; Drawer_id: 1; Voltage_Rating: 50V; Package: CAP 0603/1608; Created_Date: 10/20/2018
C12 = 943: Manufacturer_id: 1; idCapacitor: 943; Name: Cap_0.10uf_50V_CAP 0603/1608; Dielectric: Ceramic; Created_By: Nick Mah; Drawer_id: 1; Voltage_Rating: 50V; Package: CAP 0603/1608; Created_Date: 10/20/2018
D3 = 7: ESD Protection Diode; Manufacturer_id: 1; idDiode: 7; Name: SOT-23_350W_Zener; Value: TVS_24V; Type: Zener; Ic: 8A; Power: 350W; Drawer_id: 1; Num_Circuits: 1; Package: SOT-23; MfrPartNo: NUP1105LT1G; Link: https://www.digikey.com/product-detail/en/on-semiconductor/NUP1105LT1G/NUP1105LT1GOSCT-ND/2122067; ComponentLink1URL: https://www.digikey.com/product-detail/en/on-semiconductor/NUP1105LT1G/NUP1105LT1GOSCT-ND/2122067; Supplier1: Digikey; Supplier1PartNo: NUP1105LT1GOSCT-ND
R15 = 289: Manufacturer_id: 1; idResistor: 289; Name: Res_1.0k_0603_1/10W_1%; Created_By: Nick Mah; Supplier 1: Digi-Key; Drawer_id: 1; Tolerance: 1%; Power: 1/10W; Package: 0603; ComponentLink1Description: Datasheet; Created_Date: 2018-10-20
R16 R17 = 1340: Manufacturer_id: 1; idResistor: 1340; Name: Res_62_0603_1/10W_5%; Created_By: Nick Mah; Supplier 1: Digi-Key; Drawer_id: 1; Tolerance: 5%; Power: 1/10W; Package: 0603; ComponentLink1Description: Datasheet; Created_Date: 2018-10-20
TEST_CANN1 TEST_CANP1 = 5: Manufacturer_id: 1; idTable: 5; Name: RCU-0C_Test_Point; Drawer_id: 1; Package: 0603; MfrPartNo: RCU-0C; Link: https://www.digikey.com/product-detail/en/te-connectivity-amp-connectors/RCU-0C/A106145CT-ND/3477802; ComponentLink1Description: Datasheet; ComponentLink1URL: https://www.te.com/commerce/DocumentDelivery/DDEController?Action=srchrtrv&DocNm=1773266&DocType=DS&DocLang=English
U4 = 9: 1/1 Transceiver Half CANbus 8-SOIC; Manufacturer_id: 1; MfrPartNo: SN65HVD233D; idIC_Interface: 9; Name: CAN Transceiver; Value: CAN to UART; Data_Rate: 1Mbps; Vin(Min): 3V; Vin(Max): 3.6V; Drawer_id: 1; Type: Transceiver; Protocol: CAN; Num_Circuits: 1; Package: SOIC-8; Link: https://www.digikey.com/products/en?mpart=SN65HVD233D&v=296; Supplier1: digikey; Supplier1PartNo: 296-14639-5-ND

## Sheet 3.3-5 and 5-3.3 Level Shifters.SchDoc
size A
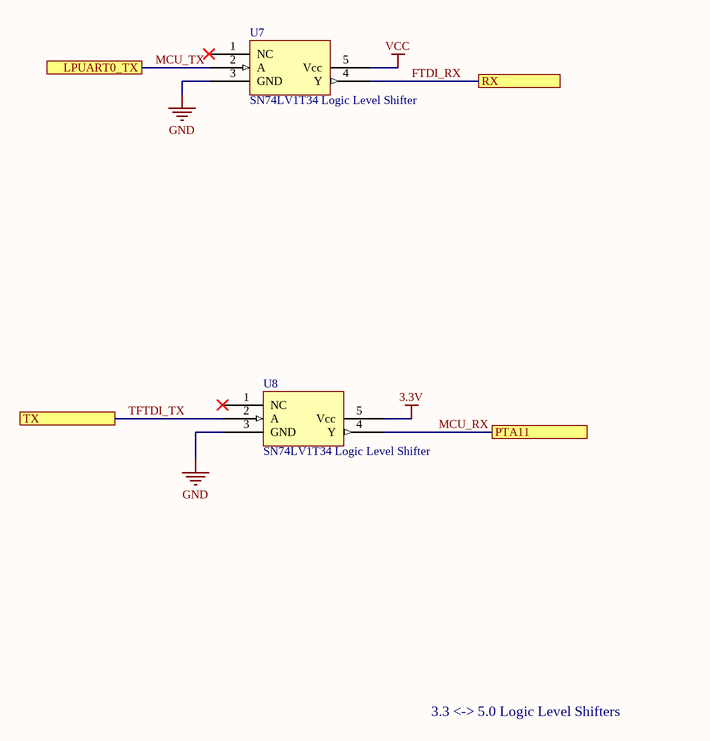
[diagram p5: 3.3-5 and 5-3.3 Level Shifters.SchDoc]

### Parts
U7  SN74LV1T34 Logic Level Shifter  [SOT23-5]
U8  SN74LV1T34 Logic Level Shifter  [SOT23-5]

### Ports
LPUART0_TX, PTA11, RX, TX

### Nets
3.3V: U8.5(Vcc)
GND: U7.3(GND) U8.3(GND)  [project net AGND]
VCC: U7.5(Vcc)  [project net DVCC]
FTDI_RX: U7.4(Y) ; port RX
MCU_RX: U8.4(Y) ; port PTA11
MCU_TX: U7.2(A) ; port LPUART0_TX
TFTDI_TX: U8.2(A) ; port TX

Not connected (* = marked no-connect by the designer): U7 1(NC)*; U8 1(NC)*

### Notes on the sheet
- 3.3 <-> 5.0 Logic Level Shifters

### Library data of the parts
U7 U8 = 32: Logic Level Shifter driven by Vcc; Manufacturer_id: 1; MfrPartNo: SN74LV1T34DBVR; idIC_Misc: 32; Protocol: Null; Vin(Min): 0V; Vin(Max): Vcc + .5V; Drawer_id: 1; Name: Level Shifter; Value: N/A; Type: N/A; Num_Circuits: 1; Data_Rate: Null; Package: SOT23-5; Link: https://www.digikey.com/product-detail/en/texas-instruments/SN74LV1T34DBVR/296-37176-1-ND/4555593; ComponentLink1Description: Null; ComponentLink1URL: Null; Supplier1: DigiKey; Supplier1PartNo: 296-37176-1-ND

## Nets that join several sheets
3.3V: Sensors1-10 (53 pins), Sensors11-20 (53 pins), Power circuit (C3.2 U1.5), 3.3V CAN_Tranceiver (C12.1 U4.3), 3.3-5 and 5-3.3 Level Shifters (U8.5)
AGND: AeroPressureSensor (X1.2), Sensors1-10 (30 pins), Sensors11-20 (30 pins), Power circuit (6 pins), 3.3V CAN_Tranceiver (5 pins), 3.3-5 and 5-3.3 Level Shifters (U7.3 U8.3)
DVCC: Power circuit (6 pins), 3.3-5 and 5-3.3 Level Shifters (U7.5)
CAN_N: AeroPressureSensor (X1.3), 3.3V CAN_Tranceiver (D3.2 R16.1 TEST_CANN1.1 U4.6)
CAN_P: AeroPressureSensor (X1.4), 3.3V CAN_Tranceiver (D3.1 R17.2 TEST_CANP1.1 U4.7)